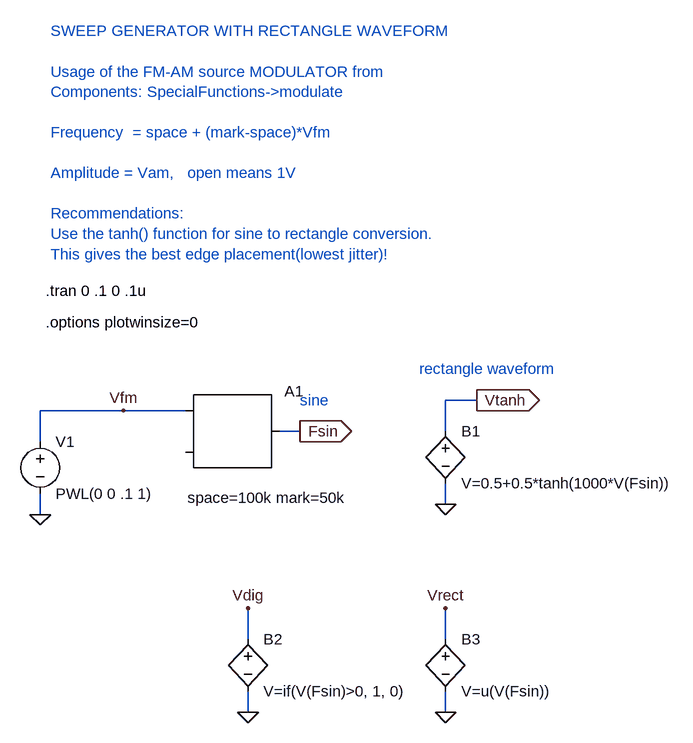
[diagram p0: schematic Swept_freq_rect.asc]
Swept_freq_rect.asc, the LTspice schematic file:
Version 4
SHEET 1 880 788
WIRE -576 304 -576 256
WIRE -576 416 -576 384
WIRE -448 256 -576 256
WIRE -352 256 -448 256
WIRE -256 608 -256 560
WIRE -256 720 -256 688
WIRE -176 288 -208 288
WIRE 48 288 48 240
WIRE 48 400 48 368
WIRE 48 608 48 560
WIRE 48 720 48 688
WIRE 96 240 48 240
FLAG -576 416 0
FLAG -176 288 Fsin
IOPIN -176 288 Out
FLAG -448 256 Vfm
FLAG 48 720 0
FLAG 48 400 0
FLAG 48 560 Vrect
FLAG 96 240 Vtanh
IOPIN 96 240 Out
FLAG -256 720 0
FLAG -256 560 Vdig
SYMBOL SpecialFunctions\\modulate -352 256 R0
WINDOW 39 3 134 Left 0
SYMATTR InstName A1
SYMATTR SpiceLine space=100k mark=50k
SYMBOL voltage -576 288 R0
WINDOW 123 0 0 Left 0
WINDOW 39 0 0 Left 0
SYMATTR InstName V1
SYMATTR Value PWL(0 0 .1 1)
SYMBOL bv 48 592 R0
SYMATTR InstName B3
SYMATTR Value V=u(V(Fsin))
SYMBOL bv 48 272 R0
SYMATTR InstName B1
SYMATTR Value V=0.5+0.5*tanh(1000*V(Fsin))
SYMBOL bv -256 592 R0
SYMATTR InstName B2
SYMATTR Value V=if(V(Fsin)>0, 1, 0)
TEXT -568 72 Left 0 !.tran 0 .1 0 .1u
TEXT -568 120 Left 0 !.options plotwinsize=0
TEXT -560 -328 Left 0 ;SWEEP GENERATOR WITH RECTANGLE WAVEFORM\n \nUsage of the FM-AM source MODULATOR from\nComponents: SpecialFunctions->modulate\n \nFrequency  = space + (mark-space)*Vfm\n \nAmplitude = Vam,   open means 1V\n \nRecommendations:\nUse the tanh() function for sine to rectangle conversion.\nThis gives the best edge placement(lowest jitter)!
TEXT 8 192 Left 0 ;rectangle waveform
TEXT -176 240 Left 0 ;sine

The netlist it stands for:
* Swept_freq_rect.asc
A1 Vfm 0 0 0 0 0 Fsin 0 MODULATOR space=100k mark=50k
V1 Vfm 0 PWL(0 0 .1 1)
B3 Vrect 0 V=u(V(Fsin))
B1 Vtanh 0 V=0.5+0.5*tanh(1000*V(Fsin))
B2 Vdig 0 V=if(V(Fsin)>0, 1, 0)
.tran 0 .1 0 .1u
.options plotwinsize=0
* SWEEP GENERATOR WITH RECTANGLE WAVEFORM
* Usage of the FM-AM source MODULATOR from
* Components: SpecialFunctions->modulate
* Frequency  = space + (mark-space)*Vfm
* Amplitude = Vam,   open means 1V
* Recommendations:
* Use the tanh() function for sine to rectangle conversion.
* This gives the best edge placement(lowest jitter)!
* rectangle waveform
* sine
.backanno
.end